# EAGLE design MAIN_AV_Final (EAGLE 9.6.2)
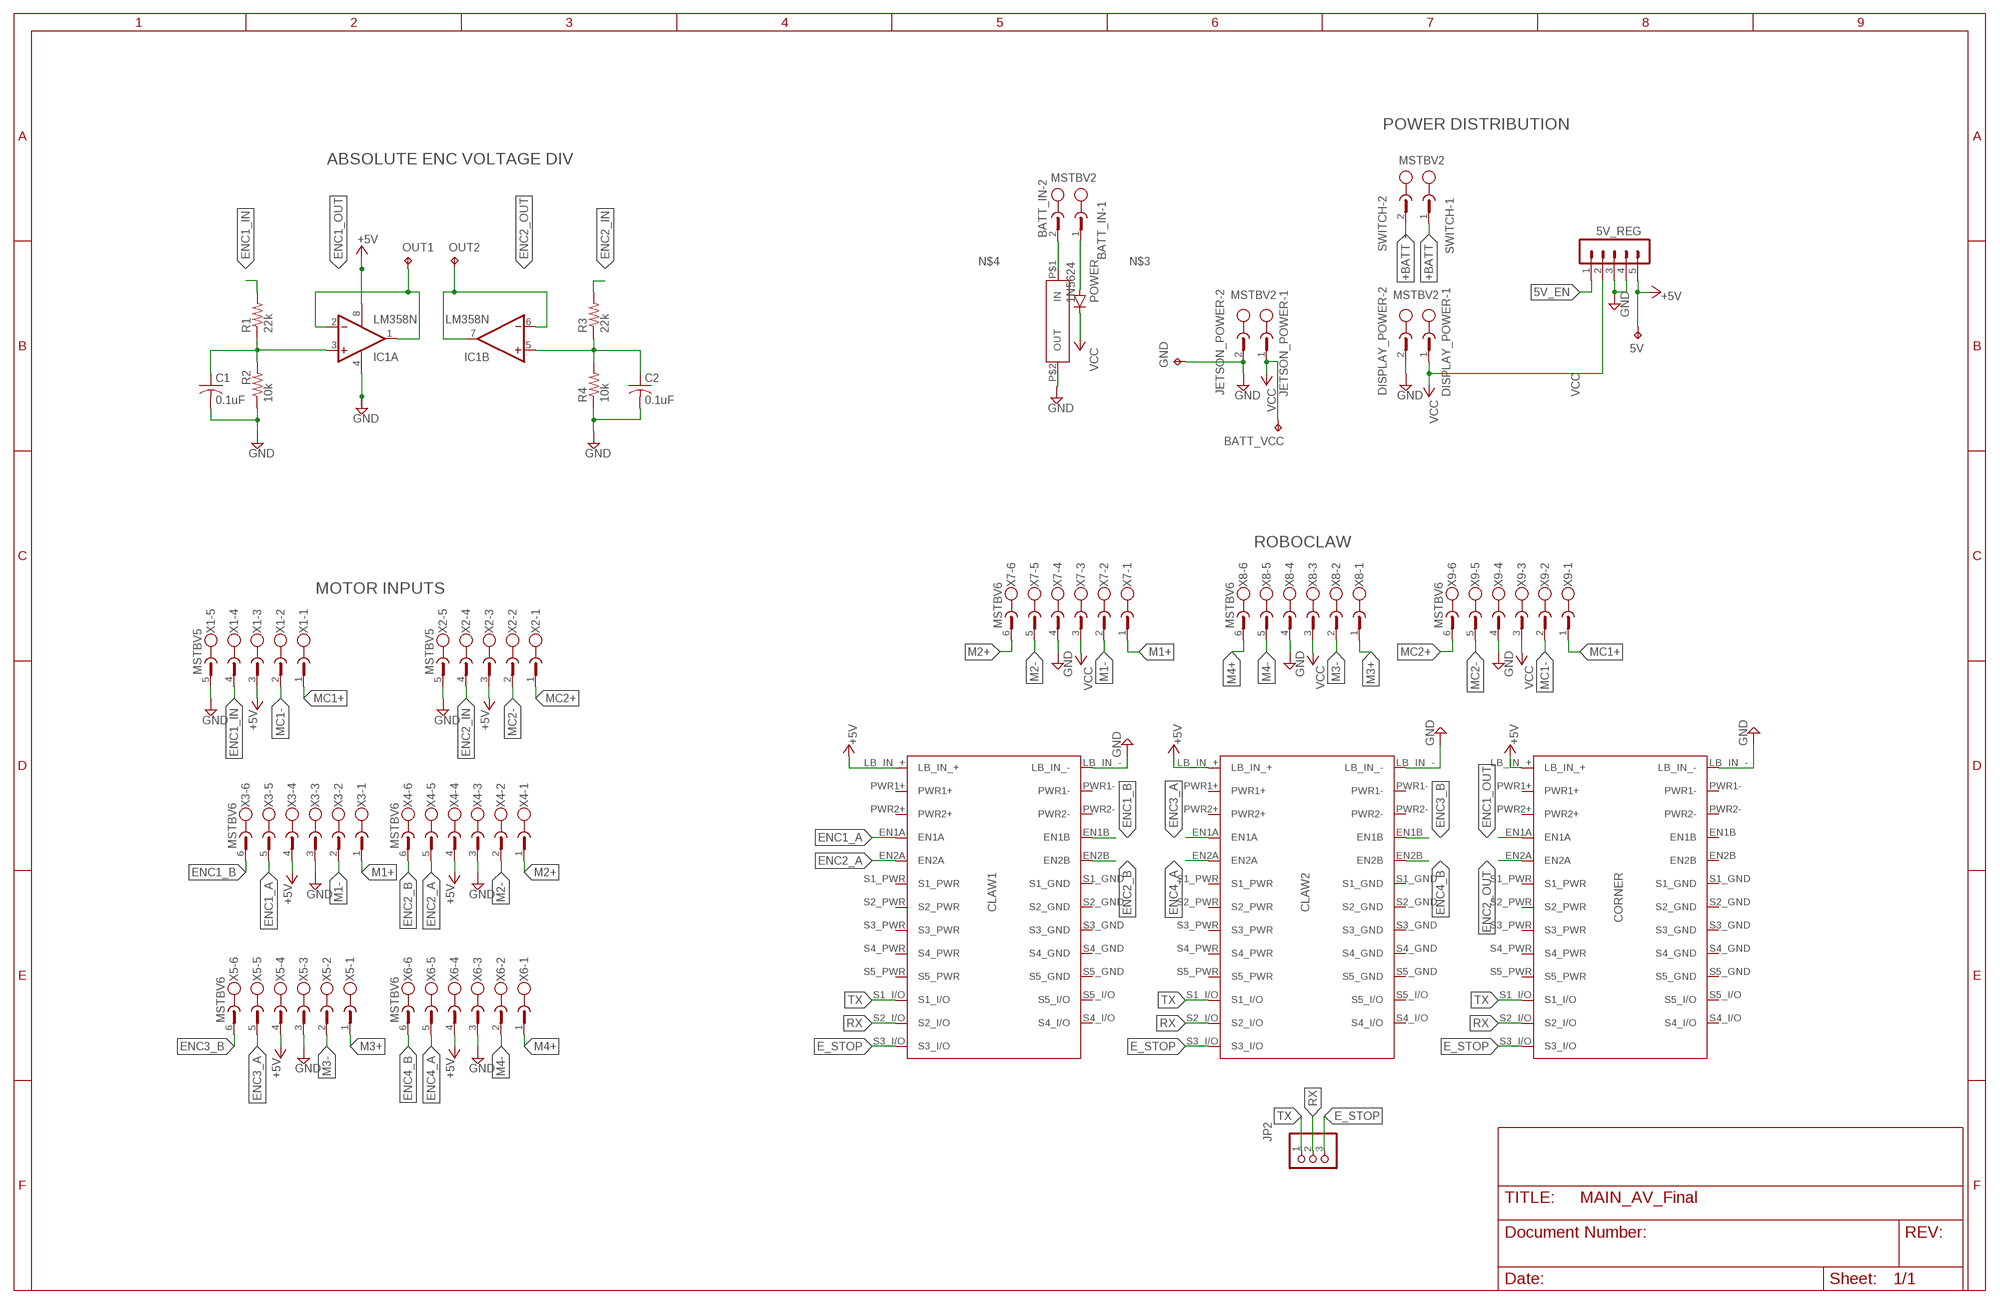
[diagram p0: schematic, sheet 1]

## Parts
5V  TPTP10SQ  [TP10SQ]
5V_REG  MA05-1  [MA05-1]
BATT_IN  MSTBV2  [MSTBV2]
BATT_VCC  TPTP10SQ  [TP10SQ]
C1  0.1uF  C-US050-024X044  [C050-024X044]
C2  0.1uF  C-US050-024X044  [C050-024X044]
CLAW1  ROBOCLAW2X7A  [ROBOCLAW]
CLAW2  ROBOCLAW2X7A  [ROBOCLAW]
CORNER  ROBOCLAW2X7A  [ROBOCLAW]
DISPLAY_POWER  MSTBV2  [MSTBV2]
GND  TPTP10SQ  [TP10SQ]
IC1  LM358N  [DIL08]
JETSON_POWER  MSTBV2  [MSTBV2]
JP2  PINHD-1X3  [1X03]
OUT1  TPTP10SQ  [TP10SQ]
OUT2  TPTP10SQ  [TP10SQ]
POWER  1N5624  [DO201-15]
R1  22k  R-US_0204/7  [0204/7]
R2  10k  R-US_0204/7  [0204/7]
R3  22k  R-US_0204/7  [0204/7]
R4  10k  R-US_0204/7  [0204/7]
SWITCH  MSTBV2  [MSTBV2]
U$1  FUSEHOLDER  [FUSEHOLDER]
X1  MSTBV5  [MSTBV5]
X2  MSTBV5  [MSTBV5]
X3  MSTBV6  [MSTBV6]
X4  MSTBV6  [MSTBV6]
X5  MSTBV6  [MSTBV6]
X6  MSTBV6  [MSTBV6]
X7  MSTBV6  [MSTBV6]
X8  MSTBV6  [MSTBV6]
X9  MSTBV6  [MSTBV6]

## Nets
5V_EN: 5V_REG.1
+5V [power_5v]: 5V.TP 5V_REG.5 CLAW1.LB_IN_+ CLAW2.LB_IN_+ CORNER.LB_IN_+ IC1.8(P:V+) X1.3 X2.3 X3.4 X4.4 X5.4 X6.4
+BATT [vcc]: SWITCH.1 SWITCH.2
E_STOP: CLAW1.S3_I/O CLAW2.S3_I/O CORNER.S3_I/O JP2.3
ENC1_A: CLAW1.EN1A X3.5
ENC1_B: CLAW1.EN1B X3.6
ENC1_IN: R1.2 X1.4
ENC1_OUT: CORNER.EN1A IC1.1(A:OUT) IC1.2(A:-IN) OUT1.TP
ENC2_A: CLAW1.EN2A X4.5
ENC2_B: CLAW1.EN2B X4.6
ENC2_IN: R3.2 X2.4
ENC2_OUT: CORNER.EN2A IC1.6(B:-IN) IC1.7(B:OUT) OUT2.TP
ENC3_A: CLAW2.EN1A X5.5
ENC3_B: CLAW2.EN1B X5.6
ENC4_A: CLAW2.EN2A X6.5
ENC4_B: CLAW2.EN2B X6.6
GND [power_5v]: 5V_REG.3 5V_REG.4 C1.2 C2.2 CLAW1.LB_IN_- CLAW2.LB_IN_- CORNER.LB_IN_- DISPLAY_POWER.2 GND.TP IC1.4(P:V-) JETSON_POWER.2 R2.1 R4.1 U$1.P$2(OUT) X1.5 X2.5 X3.3 X4.3 X5.3 X6.3 X7.4 X8.4 X9.4
M1+ [motor]: X3.1 X7.1
M1- [motor]: X3.2 X7.2
M2+ [motor]: X4.1 X7.6
M2- [motor]: X4.2 X7.5
M3+ [motor]: X5.1 X8.1
M3- [motor]: X5.2 X8.2
M4+ [motor]: X6.1 X8.6
M4- [motor]: X6.2 X8.5
MC1+ [motor]: X1.1 X9.1
MC1- [motor]: X1.2 X9.2
MC2+ [motor]: X2.1 X9.6
MC2- [motor]: X2.2 X9.5
N$1: C1.1 IC1.3(A:+IN) R1.1 R2.2
N$2: C2.1 IC1.5(B:+IN) R3.1 R4.2
N$3 [vcc]: BATT_IN.1 POWER.A
N$4 [vcc]: BATT_IN.2 U$1.P$1(IN)
RX: CLAW1.S2_I/O CLAW2.S2_I/O CORNER.S2_I/O JP2.2
TX: CLAW1.S1_I/O CLAW2.S1_I/O CORNER.S1_I/O JP2.1
VCC: 5V_REG.2 BATT_VCC.TP DISPLAY_POWER.1 JETSON_POWER.1 POWER.C X7.3 X8.3 X9.3
Unconnected: CLAW1.PWR1+ CLAW1.PWR1- CLAW1.PWR2+ CLAW1.PWR2- CLAW1.S1_GND CLAW1.S1_PWR CLAW1.S2_GND CLAW1.S2_PWR CLAW1.S3_GND CLAW1.S3_PWR CLAW1.S4_GND CLAW1.S4_I/O CLAW1.S4_PWR CLAW1.S5_GND CLAW1.S5_I/O CLAW1.S5_PWR CLAW2.PWR1+ CLAW2.PWR1- CLAW2.PWR2+ CLAW2.PWR2- CLAW2.S1_GND CLAW2.S1_PWR CLAW2.S2_GND CLAW2.S2_PWR CLAW2.S3_GND CLAW2.S3_PWR CLAW2.S4_GND CLAW2.S4_I/O CLAW2.S4_PWR CLAW2.S5_GND CLAW2.S5_I/O CLAW2.S5_PWR CORNER.EN1B CORNER.EN2B CORNER.PWR1+ CORNER.PWR1- CORNER.PWR2+ CORNER.PWR2- CORNER.S1_GND CORNER.S1_PWR CORNER.S2_GND CORNER.S2_PWR CORNER.S3_GND CORNER.S3_PWR CORNER.S4_GND CORNER.S4_I/O CORNER.S4_PWR CORNER.S5_GND CORNER.S5_I/O CORNER.S5_PWR

## Notes on the sheet
- POWER DISTRIBUTION
- ABSOLUTE ENC VOLTAGE DIV
- ROBOCLAW
- MOTOR INPUTS

## Library data of the parts
5V BATT_VCC GND OUT1 OUT2 = testpad:TP: Test pad
5V_REG = con-lstb:MA05-1: PIN HEADER; OC_FARNELL: unknown; OC_NEWARK: unknown
BATT_IN DISPLAY_POWER JETSON_POWER SWITCH = con-phoenix-508:MSTBV2: PHOENIX; MPN: MSTBV 2,5/2-GF-5.08; OC_FARNELL: 1792792; OC_NEWARK: 69R9845
C1 C2 = rcl:C-US: CAPACITOR, American symbol; SPICEPREFIX: C
CLAW1 CLAW2 CORNER = Roboclaw_New:ROBOCLAW2X7A
IC1 = linear:LM358: OP AMP also LM158; LM258; LM2904 Source: http://cache.national.com/ds/LM/LM158.pdf
JP2 = pinhead:PINHD-1X3: PIN HEADER
POWER = diode:1N5624: DIODE controlled avalanche rectifier
R1-R4 = rcl:R-US_: RESISTOR, American symbol; SPICEPREFIX: R
U$1 = Fuse_Holder:FUSEHOLDER
X1 X2 = con-phoenix-508:MSTBV5: PHOENIX; MPN: MSTBV 2,5/5-GF-5.08; OC_FARNELL: 1792795; OC_NEWARK: 69R9848
X3-X9 = con-phoenix-508:MSTBV6: PHOENIX; MPN: MSTBV 2,5/6-GF-5.08; OC_FARNELL: 1792796; OC_NEWARK: 69R9849

## Net classes
0 default: width 0.33 mm
1 power_5v: width 0.508 mm
2 motor: width 3.302 mm
3 vcc: width 4.064 mm

## Board
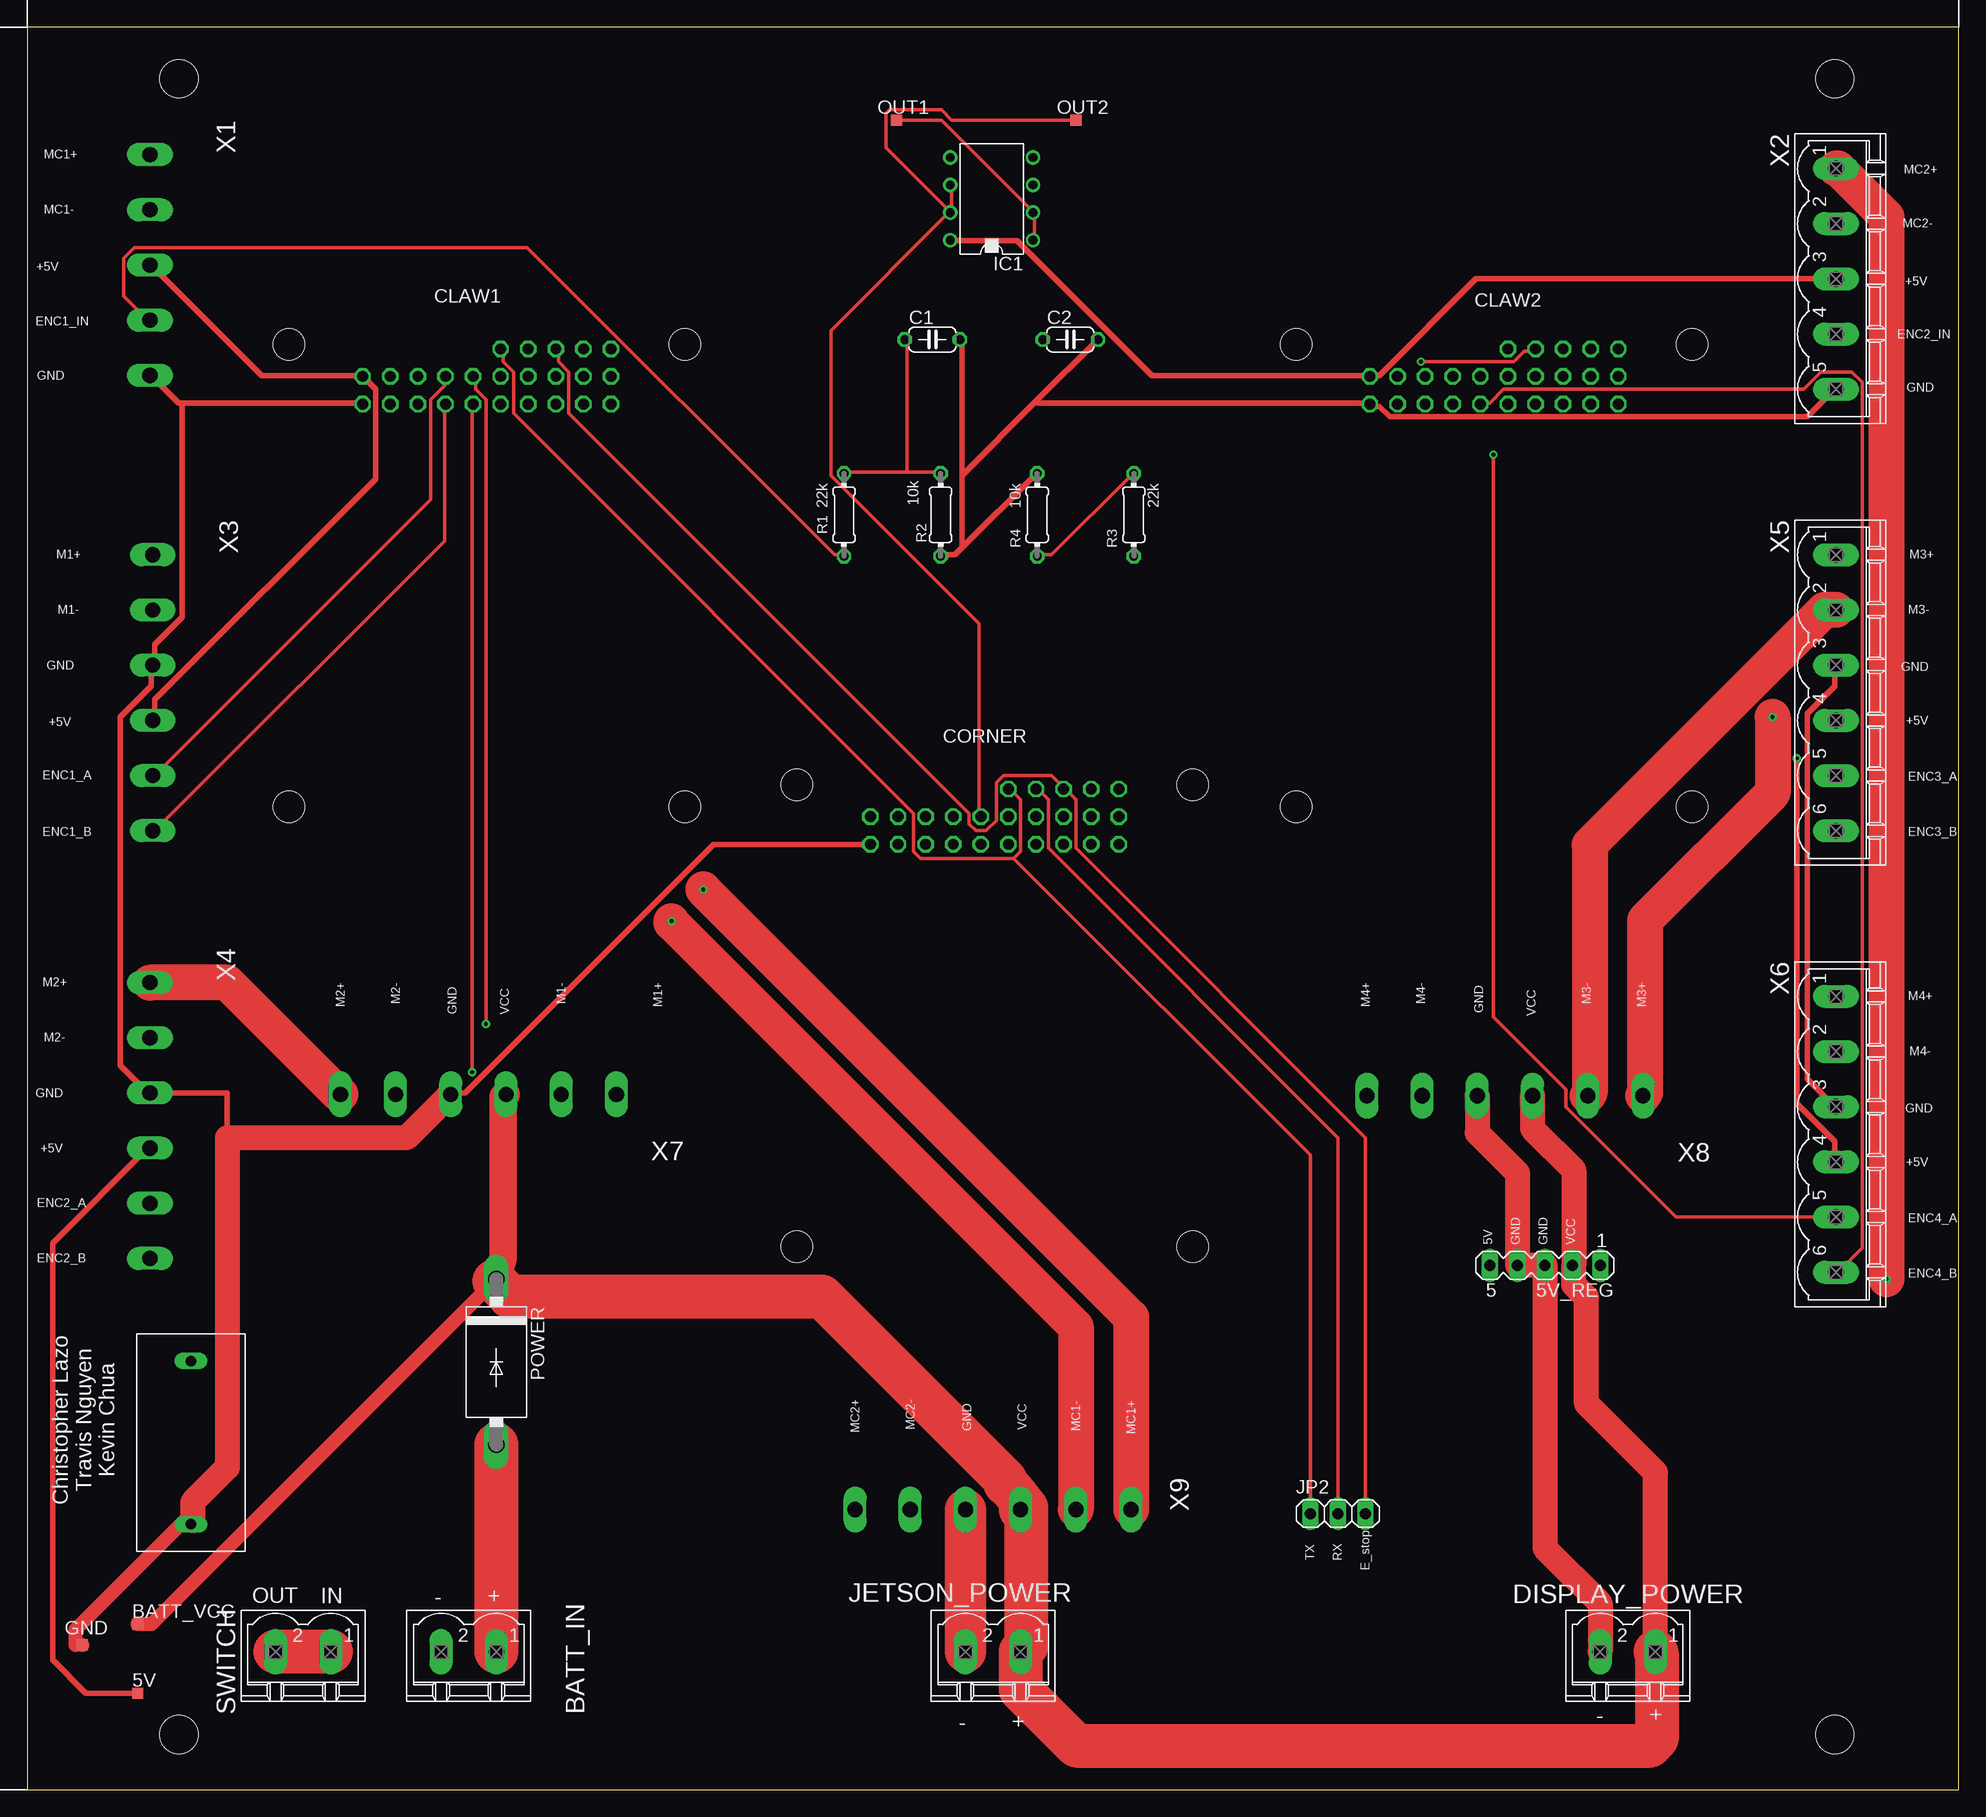
[diagram p1: board, top side]
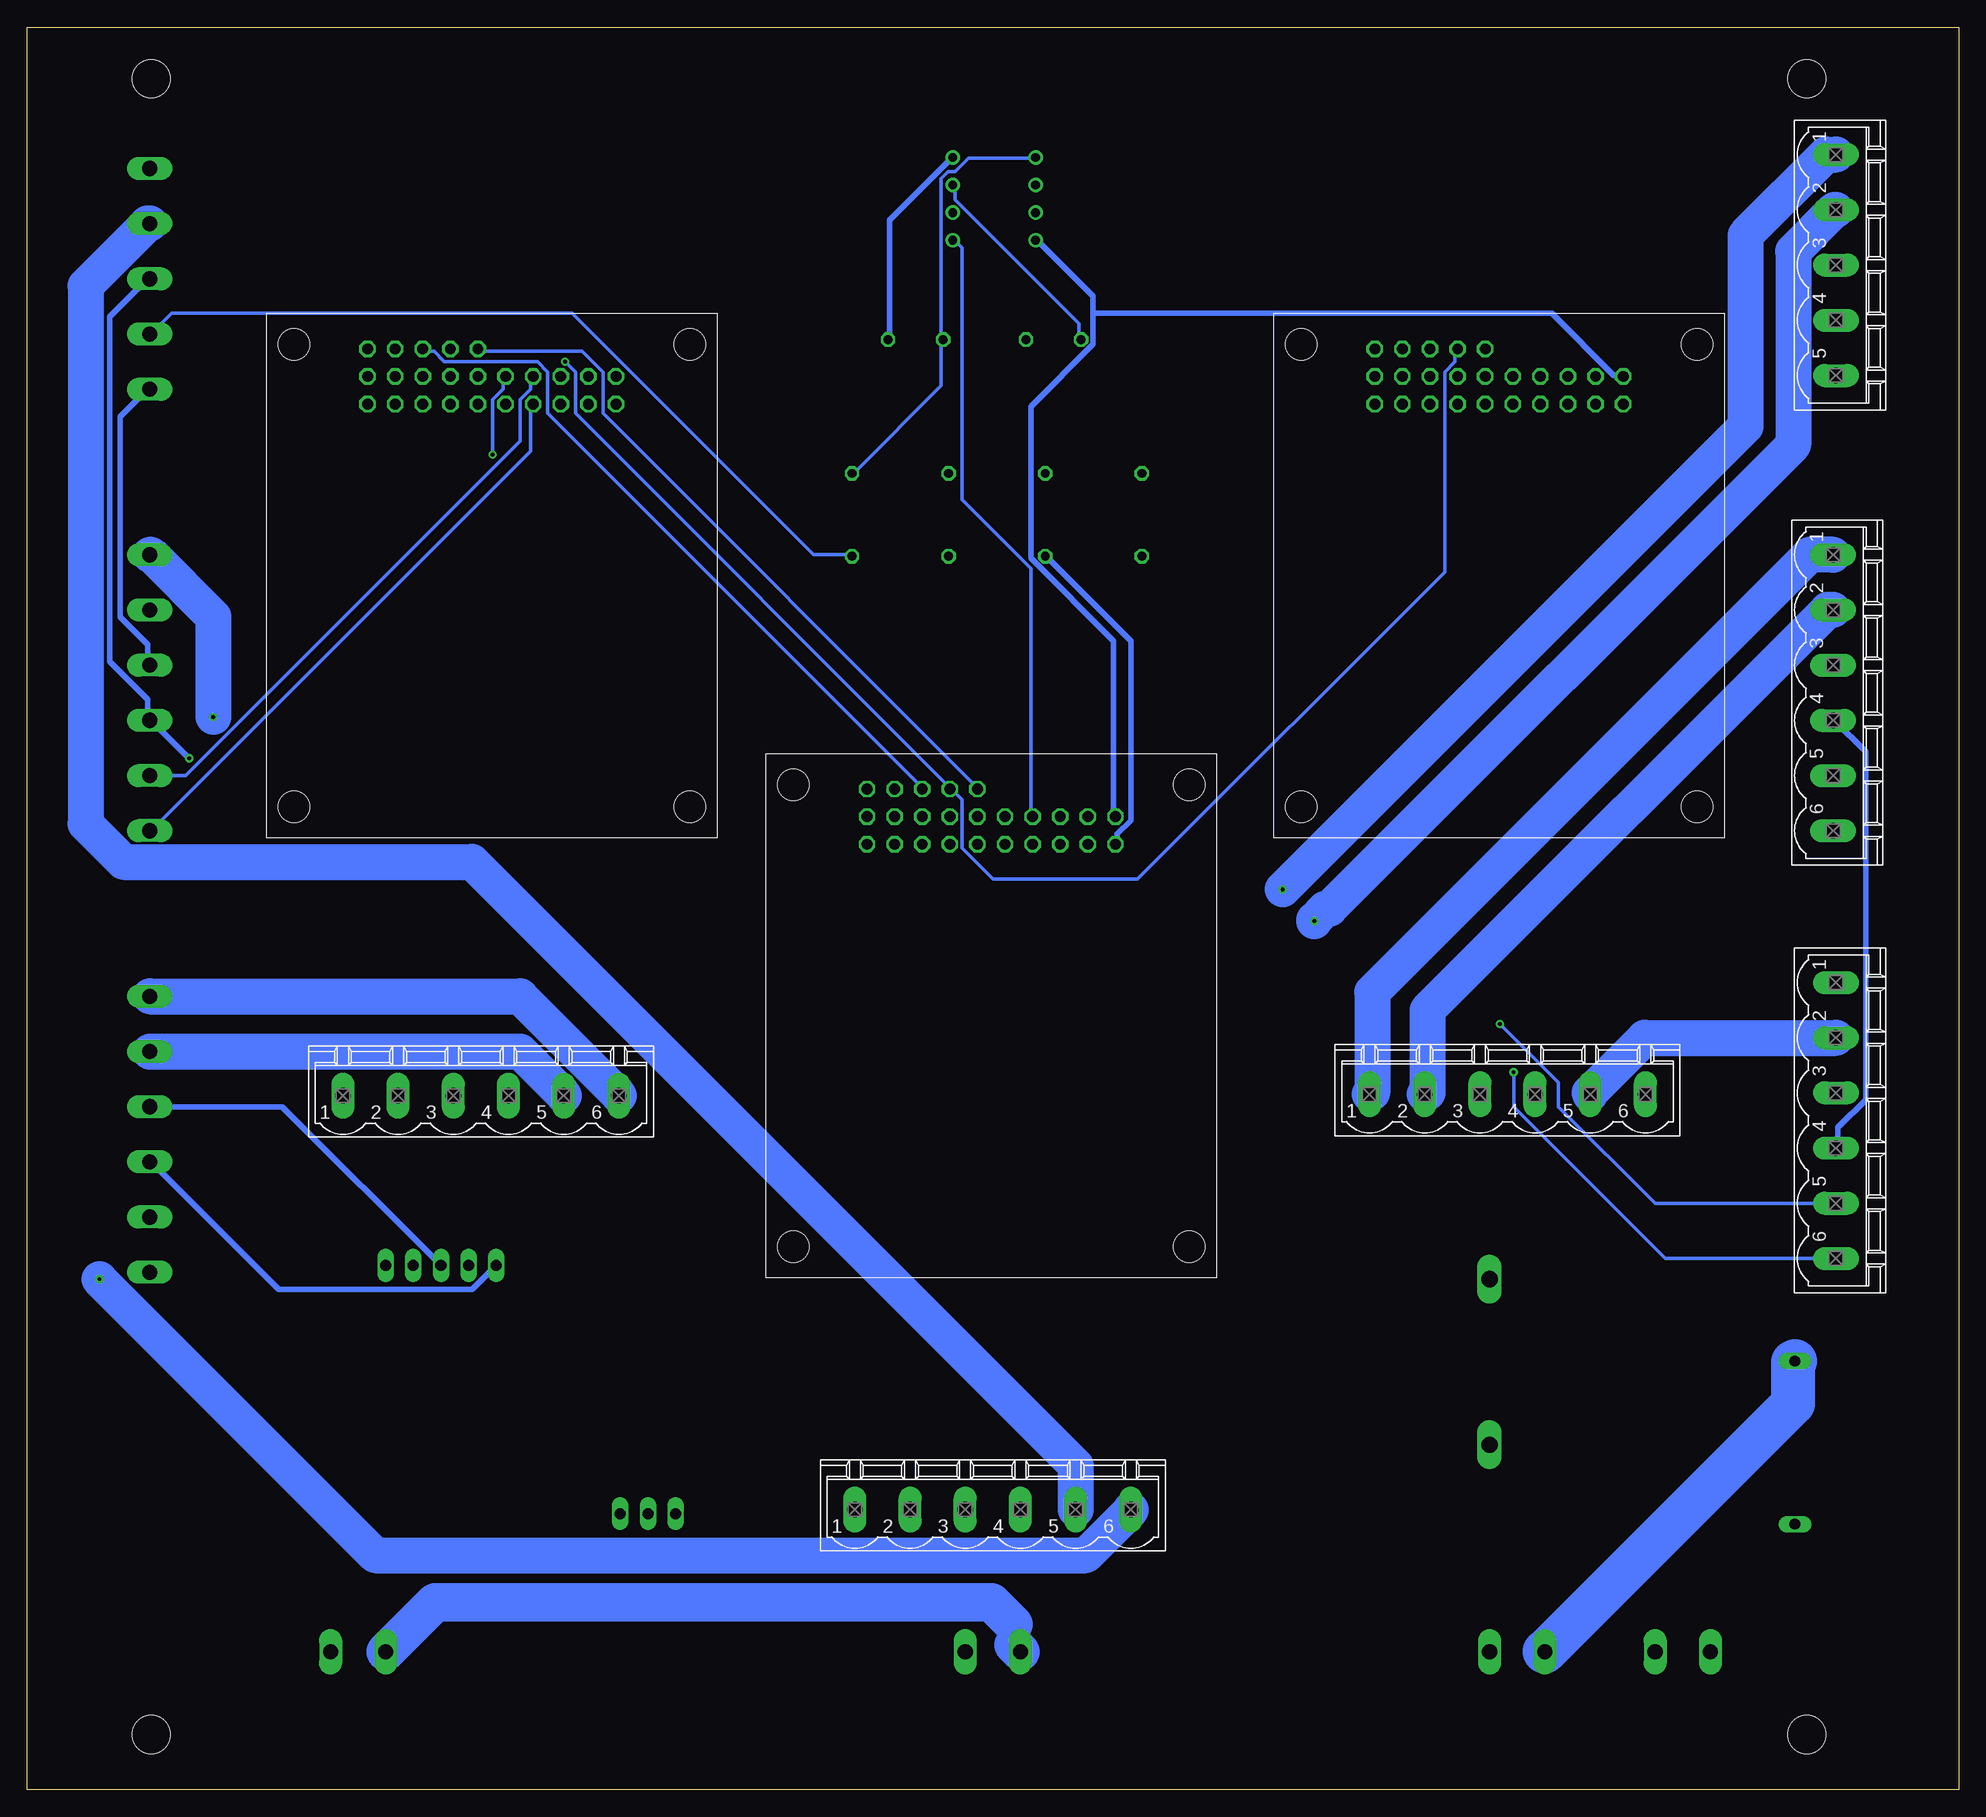
[diagram p2: board, bottom side, seen from below]

Size 177.78 x 162.23 mm. Coordinates in mm from the lower left corner, seen from the top.
Outline: 0,0 177.78,0 177.78,162.23 0,162.23 0,0
Copper layers (1*16): Top 0.035mm / dielectric 1.5mm / Bottom 0.035mm
Design rules "default": minimum track width 6mil, minimum drill 0.35mm, track to track 6mil, track to pad 6mil, pad to pad 6mil, via to via 6mil, smd to smd 6mil, copper to edge 40mil, drill to drill 6mil, minimum pad ring 10mil, minimum via ring 8mil, stop-mask expansion 4mil, vias tented up to drill 0mil, thermal gap 10mil
Holes 3.5 mm at 13.97,157.48 166.37,157.48 13.97,5.08 166.37,5.08

### Footprints (pad centres in the part's own frame; a part is rotated, then mirrored left to right if it is on the bottom)
TP10SQ = smd 1 x 1: TP 0,0
MA05-1 = drill 1.016 long: 1 -5.08,0; 2 -2.54,0; 3 0,0; 4 2.54,0; 5 5.08,0
MSTBV2 = drill 1.397 long: 1 -2.54,0; 2 2.54,0
C050-024X044 = drill 0.813 octagon: 1 -2.54,0; 2 2.54,0
ROBOCLAW = drill 1 octagon: EN1A 16.91,5.81; EN1B 16.91,8.35; EN2A 19.45,5.81; EN2B 19.45,8.35; LB_IN_+ 9.29,5.81; LB_IN_- 9.29,8.35; PWR1+ 11.83,5.81; PWR1- 11.83,8.35; PWR2+ 14.37,5.81; PWR2- 14.37,8.35; S1_GND 21.99,8.35; S1_I/O 21.99,3.27; S1_PWR 21.99,5.81; S2_GND 24.53,8.35; S2_I/O 24.53,3.27; S2_PWR 24.53,5.81; S3_GND 27.07,8.35; S3_I/O 27.07,3.27; S3_PWR 27.07,5.81; S4_GND 29.61,8.35; S4_I/O 29.61,3.27; S4_PWR 29.61,5.81; S5_GND 32.15,8.35; S5_I/O 32.15,3.27; S5_PWR 32.15,5.81 | hole 2.9: 2.5,2.87; 2.5,45.41; 38.94,45.41; 38.94,2.87
DIL08 = drill 0.813 pad 1.27: 1 -3.81,-3.81; 2 -1.27,-3.81; 3 1.27,-3.81; 4 3.81,-3.81; 5 3.81,3.81; 6 1.27,3.81; 7 -1.27,3.81; 8 -3.81,3.81
1X03 = drill 1.016 long: 1 -2.54,0; 2 0,0; 3 2.54,0
DO201-15 = drill 1.499 long: A 7.62,0; C -7.62,0
0204/7 = drill 0.813 octagon: 1 -3.81,0; 2 3.81,0
FUSEHOLDER = drill 1 long: P$1 5,10; P$2 20,10
MSTBV5 = drill 1.397 long: 1 -10.16,0; 2 -5.08,0; 3 0,0; 4 5.08,0; 5 10.16,0
MSTBV6 = drill 1.397 long: 1 -12.7,0; 2 -7.62,0; 3 -2.54,0; 4 2.54,0; 5 7.62,0; 6 12.7,0

### Placement (x,y rotation side)
5V  10.16,8.89 0 top
5V_REG  139.7,48.26 180 top
BATT_IN  40.64,12.7 180 top
BATT_VCC  10.16,15.24 0 top
C1  83.31,133.48 0 top
C2  96.01,133.48 0 top
CLAW1  21.59,135.89 180 bottom
CLAW2  114.3,135.89 180 bottom
CORNER  68.33,95.38 180 bottom
DISPLAY_POWER  147.32,12.7 180 top
GND  5.08,13.34 0 top
IC1  88.77,146.43 90 top
JETSON_POWER  88.9,12.7 180 top
JP2  120.65,25.4 0 top
OUT1  80.01,153.67 0 top
OUT2  96.52,153.67 0 top
POWER  43.18,39.37 270 top
R1  75.18,117.35 270 top
R2  84.07,117.35 90 top
R3  101.85,117.35 270 top
R4  92.96,117.35 270 top
SWITCH  25.4,12.7 180 top
U$1  5.08,44.45 270 top
X1  11.3,140.34 270 bottom
X2  166.5,139.06 270 top
X3  11.56,100.97 270 bottom
X4  11.3,61.59 270 bottom
X5  166.5,100.97 270 top
X6  166.5,60.33 270 top
X7  41.53,64.01 0 bottom
X8  136.02,63.88 0 bottom
X9  88.9,25.78 0 bottom

### Tracks (layer width: path | path; a pad name or v marks a point on that pad's centre or on a via)
+5V  (via drill 0.35)
  Top 0.508: 5V.TP 5.4,8.89 2.35,11.94 2.35,50.29 11.11,59.05 X4.4 | X1.3 11.43,140.34 21.59,130.18 30.8,130.18 CLAW1.LB_IN_+ 31.11,129.86 32.07,128.91 32.07,120.65 11.75,100.33 11.75,98.42 X3.4 | IC1.8 85.09,142.56 91.12,142.56 103.5,130.18 123.51,130.18 CLAW2.LB_IN_+ 123.83,130.18 124.46,130.18 133.35,139.06 X2.3 | v162.88,94.93 162.88,63.18 166.37,59.69 166.37,57.78 X6.4
  Bottom 0.508: X4.4 11.11,59.05 11.11,60.96 8.57,63.5 8.57,95.57 11.43,98.42 X3.4 | 79.69,135.89 79.69,137.48 84.77,142.56 IC1.8 | 79.69,135.89 79.69,133.03 85.41,127.32 85.41,113.35 77.79,105.73 77.79,89.85 CORNER.LB_IN_+ | 5V_REG.5 136.84,46.04 154.62,46.04 166.37,57.78 X6.4 | X2.3 166.69,139.06 170.18,135.57 170.18,103.82 166.69,100.33 166.69,98.42 X5.4 166.37,98.42 v162.88,94.93 | 79.69,135.89 37.47,135.89 31.75,130.18 31.11,130.18 CLAW1.LB_IN_+
+BATT
  Top 4.064: SWITCH.1 SWITCH.2
E_STOP
  Top 0.33: CLAW1.S3_I/O 48.9,132.4 48.9,131.44 49.85,130.49 49.85,126.68 86.68,89.85 86.68,88.9 87.31,88.27 88.27,88.27 89.22,89.22 89.22,92.71 89.85,93.34 94.3,93.34 95.25,92.39 CORNER.S3_I/O 95.57,92.08 96.52,91.12 96.52,86.68 123.19,60.01 JP2.3
  Bottom 0.33: CLAW2.S3_I/O 141.29,132.4 140.34,132.4 139.38,131.44 130.81,131.44 129.86,130.49 129.86,126.68 95.57,92.39 CORNER.S3_I/O
ENC1_A
  Top 0.33: CLAW1.EN1A 38.42,129.86 38.42,129.22 37.15,127.95 37.15,118.75 11.75,93.34 X3.5
ENC1_B
  Top 0.33: CLAW1.EN1B 38.42,127.32 38.42,114.94 11.75,88.27 X3.6
ENC1_IN
  Top 0.33: R1.2 74.93,113.67 74.3,113.67 46.04,141.92 9.84,141.92 8.89,140.97 8.89,137.48 11.11,135.25 X1.4
ENC1_OUT
  Top 0.33: OUT1.TP 84.14,153.67 92.39,145.41 IC1.2 92.71,145.1 92.71,142.88 IC1.1
  Bottom 0.33: CORNER.EN1A 85.41,89.85 85.41,112.39 91.76,118.75 91.76,141.92 92.39,142.56 IC1.1
ENC2_A  (via drill 0.35)
  Top 0.33: v42.23,70.48 42.23,127.95 41.27,128.91 41.27,129.86 CLAW1.EN2A
  Bottom 0.33: v42.23,70.48 36.83,65.09 36.83,62.87 27.94,53.98 X4.5
ENC2_B  (via drill 0.35)
  Top 0.33: v40.96,66.04 40.96,127.32 CLAW1.EN2B
  Bottom 0.33: v40.96,66.04 40.96,62.87 26.99,48.9 X4.6
ENC2_IN
  Bottom 0.33: R3.2 101.92,113.67 105.41,113.67 127.64,135.89 164.47,135.89 166.37,133.99 X2.4
ENC2_OUT
  Top 0.33: OUT2.TP 85.09,153.67 84.14,154.62 79.38,154.62 79.06,154.31 79.06,151.13 84.77,145.41 IC1.7 | IC1.6 85.09,147.64 85.09,145.41 IC1.7 | CORNER.EN2A 87.63,89.85 87.63,107.31 73.98,120.97 73.98,134.3 84.77,145.1 IC1.7
ENC3_A
  Bottom 0.33: X5.5 163.19,93.34 132.4,124.14 132.4,127.95 131.44,128.91 131.44,129.86 CLAW2.EN1A
ENC3_B
  Bottom 0.33: CLAW2.EN1B 131.44,127.32 131.44,123.19 166.37,88.27 X5.6
ENC4_A  (via drill 0.35)
  Top 0.33: v134.94,122.87 134.94,71.12 141.6,64.45 141.6,62.87 151.76,52.7 X6.5
  Bottom 0.33: v134.94,122.87 134.94,127.95 133.99,128.91 133.99,129.86 CLAW2.EN2A
ENC4_B
  Top 0.33: CLAW2.EN2B 133.99,127.64 134.62,127.64 135.89,128.91 163.51,128.91 165.1,130.49 167.96,130.49 168.91,129.54 168.91,49.85 166.69,47.62 X6.6
GND
  Top 0.508: 14.29,127.64 13.97,127.64 11.43,130.18 X1.5 | 14.29,127.64 30.8,127.64 CLAW1.LB_IN_- | 14.29,127.64 14.29,107.95 11.75,105.41 11.75,103.5 X3.3 11.43,103.5 11.43,101.6 8.57,98.74 8.57,66.67 11.11,64.14 X4.3 18.41,64.14 18.41,60.01 | 38.73,63.82 X7.4 39.05,64.14 40.32,64.14 63.18,87 77.47,87 CORNER.LB_IN_- | 15.24,24.77 U$1.P$2 | 86.2,114.46 92.71,120.97 R4.1 | 86.2,114.46 85.41,113.67 84.14,113.67 R2.1 | 86.04,120.97 86.04,114.62 86.2,114.46 | 86.04,120.97 86.04,133.35 C1.2 | 86.04,120.97 92.87,127.79 | 92.87,127.79 C2.2 | 92.87,127.79 93.03,127.64 123.51,127.64 CLAW2.LB_IN_- 123.83,127.32 124.46,127.32 125.41,126.36 163.83,126.36 166.37,128.91 X2.5 | X5.3 166.37,103.5 166.37,101.6 163.83,99.06 163.83,65.41 166.37,62.87 X6.3
  Top 1.27: GND.TP 4.45,13.34 4.45,14.73 14.45,24.73 14.8,24.73 U$1.P$2
  Top 2.286: 38.73,63.82 34.92,60.01 18.41,60.01 18.41,29.65 15.24,26.48 15.24,24.77 | X8.4 133.48,60.45 137.16,56.77 5V_REG.4 5V_REG.3 139.7,22.23 144.78,17.14 DISPLAY_POWER.2
  Top 3.81: X9.4 JETSON_POWER.2
  Bottom 0.508: IC1.4 92.71,150.18 98.42,144.46 98.42,133.67 C2.2 | CORNER.LB_IN_- 77.47,87.31 77.47,87.95 76.2,89.22 76.2,105.73 83.82,113.35 R2.1 | X5.3 166.69,103.5 166.69,105.41 169.23,107.95 169.23,126.36 166.69,128.91 X2.5 | X6.3 154.31,62.87 5V_REG.3 | 87,15.24 87,13.34
  Bottom 3.556: 87,13.34 JETSON_POWER.2 | 87,15.24 89.03,17.27 140.21,17.27 DISPLAY_POWER.2
M1+
  Bottom 3.302: X3.1 13.72,113.67 53.98,73.41 53.98,64.14 X7.1
M1-
  Bottom 3.302: X3.2 12.06,108.58 48.9,71.75 48.9,64.14 X7.2
M2+
  Top 3.302: X4.1 18.41,74.3 28.57,64.14 X7.6
M2-
  Bottom 3.302: X4.2 28.89,69.22 33.97,64.14 X7.5
M3+  (via drill 0.35)
  Top 3.302: v160.66,98.74 160.66,91.76 148.91,80.01 148.91,64.14 X8.1
  Bottom 3.302: v160.66,98.74 160.66,107.95 166.37,113.67 X5.1
M3-
  Top 3.302: X5.2 165.42,108.58 143.83,87 143.83,64.14 X8.2
M4+
  Bottom 3.302: X6.1 132.4,73.03 123.51,64.14 X8.6
M4-
  Bottom 3.302: X6.2 132.4,67.94 128.59,64.14 X8.5
MC1+  (via drill 0.35)
  Top 3.302: X9.1 101.6,43.5 v62.23,82.87
  Bottom 3.302: v62.23,82.87 19.62,125.48 19.62,143.06 12.19,150.5 X1.1
MC1-  (via drill 0.35)
  Top 3.302: X9.2 96.52,42.61 59.31,79.82 v59.31,79.95
  Bottom 3.302: v59.31,79.95 59.31,80.07 58.29,81.09 57.91,81.09 15.24,123.76 15.24,141.6 11.43,145.41 X1.2
MC2+  (via drill 0.35)
  Top 3.302: v171.13,46.99 171.13,144.78 166.69,149.22 X2.1
  Bottom 3.302: v171.13,46.99 145.73,21.59 80.33,21.59 76.2,25.72 X9.6
MC2-
  Bottom 3.302: X9.5 81.28,29.84 136.84,85.41 168.91,85.41 172.4,88.9 172.4,138.43 166.69,144.15 X2.2
N$1
  Top 0.33: 80.96,121.28 83.82,121.28 R2.2 | 80.96,121.28 75.25,121.28 R1.1 | 80.96,121.28 80.96,133.35 C1.1
  Bottom 0.33: IC1.3 92.39,147.64 92.39,146.37 80.96,134.94 80.96,133.67 C1.1
N$2
  Top 0.33: R4.2 93.03,113.67 94.3,113.67 101.6,120.97 R3.1
  Bottom 0.33: R3.1 101.6,121.28 93.66,129.22 93.66,133.35 C2.1 93.66,133.67 93.66,148.27 93.03,148.91 92.39,148.91 91.12,150.18 85.09,150.18 IC1.5
N$3
  Top 4.064: POWER.A BATT_IN.1
N$4
  Bottom 4.064: BATT_IN.2 15.24,35.56 15.24,39.37 U$1.P$1
RX  (via drill 0.35)
  Top 0.33: v128.27,131.44 136.84,131.44 137.79,132.4 138.75,132.4 CLAW2.S2_I/O | JP2.2 120.65,60.01 93.98,86.68 93.98,91.12 93.03,92.08 CORNER.S2_I/O
  Bottom 0.33: CLAW1.S2_I/O 46.35,132.4 46.35,131.44 47.31,130.49 47.31,112.08 75.56,83.82 88.9,83.82 91.76,86.68 91.76,91.12 92.71,92.08 CORNER.S2_I/O 93.03,92.39 127.32,126.68 127.32,130.49 v128.27,131.44
TX
  Top 0.33: 90.81,85.72 82.23,85.72 81.6,86.36 81.6,89.85 44.77,126.68 44.77,130.49 43.81,131.44 43.81,132.4 CLAW1.S1_I/O | 90.81,85.72 91.44,86.36 91.44,91.12 90.49,92.08 CORNER.S1_I/O | JP2.1 118.11,58.42 90.81,85.72
  Bottom 0.33: CLAW2.S1_I/O 136.21,132.4 126.68,132.4 124.78,130.49 124.78,126.68 90.49,92.39 CORNER.S1_I/O
VCC
  Top 1.27: BATT_VCC.TP 11.43,15.24 43.02,46.83
  Top 1.905: 142.34,48.16 5V_REG.2
  Top 2.286: DISPLAY_POWER.1 149.86,29.21 143.51,35.56 143.51,45.32 142.34,46.49 142.34,48.16 142.34,57.05 138.56,60.83 X8.3
  Top 2.54: 43.02,46.83 POWER.C 43.81,48.9 43.81,63.82 X7.3
  Top 4.064: 91.95,25.97 91.95,13.21 JETSON_POWER.1 91.44,9.21 96.58,4.06 149.35,4.06 149.99,4.7 149.99,12.57 DISPLAY_POWER.1 | 91.95,25.97 91.63,25.97 X9.3 | 91.95,25.97 90.68,27.56 90.04,28.19 90.04,28.51 73.15,45.4 44.45,45.4 43.02,46.83

### Text on the board
tNames: MC1+ | MC2+ | MC1- | MC2- | +5V | +5V | ENC1_IN | ENC2_IN | GND | GND | 10k | 22k | 10k | 22k | M1+ | M3+ | M1- | M3- | GND | GND | +5V | +5V | ENC1_A | ENC3_A | ENC1_B | ENC3_B | M2+ | M2+ | M2- | GND | VCC | M1- | M1+ | M4+ | M4- | GND | VCC | M3- | M3+ | M4+ | M2- | M4- | GND | GND | +5V | +5V | ENC2_A | ENC4_A | 5V | GND | GND | VCC | ENC2_B | ENC4_B | MC2+ | MC2- | GND | VCC | MC1- | MC1+ | Christopher Lazo / Travis Nguyen / Kevin Chua | TX | RX | E_stop | IN | OUT | - | + | + | - | + | -